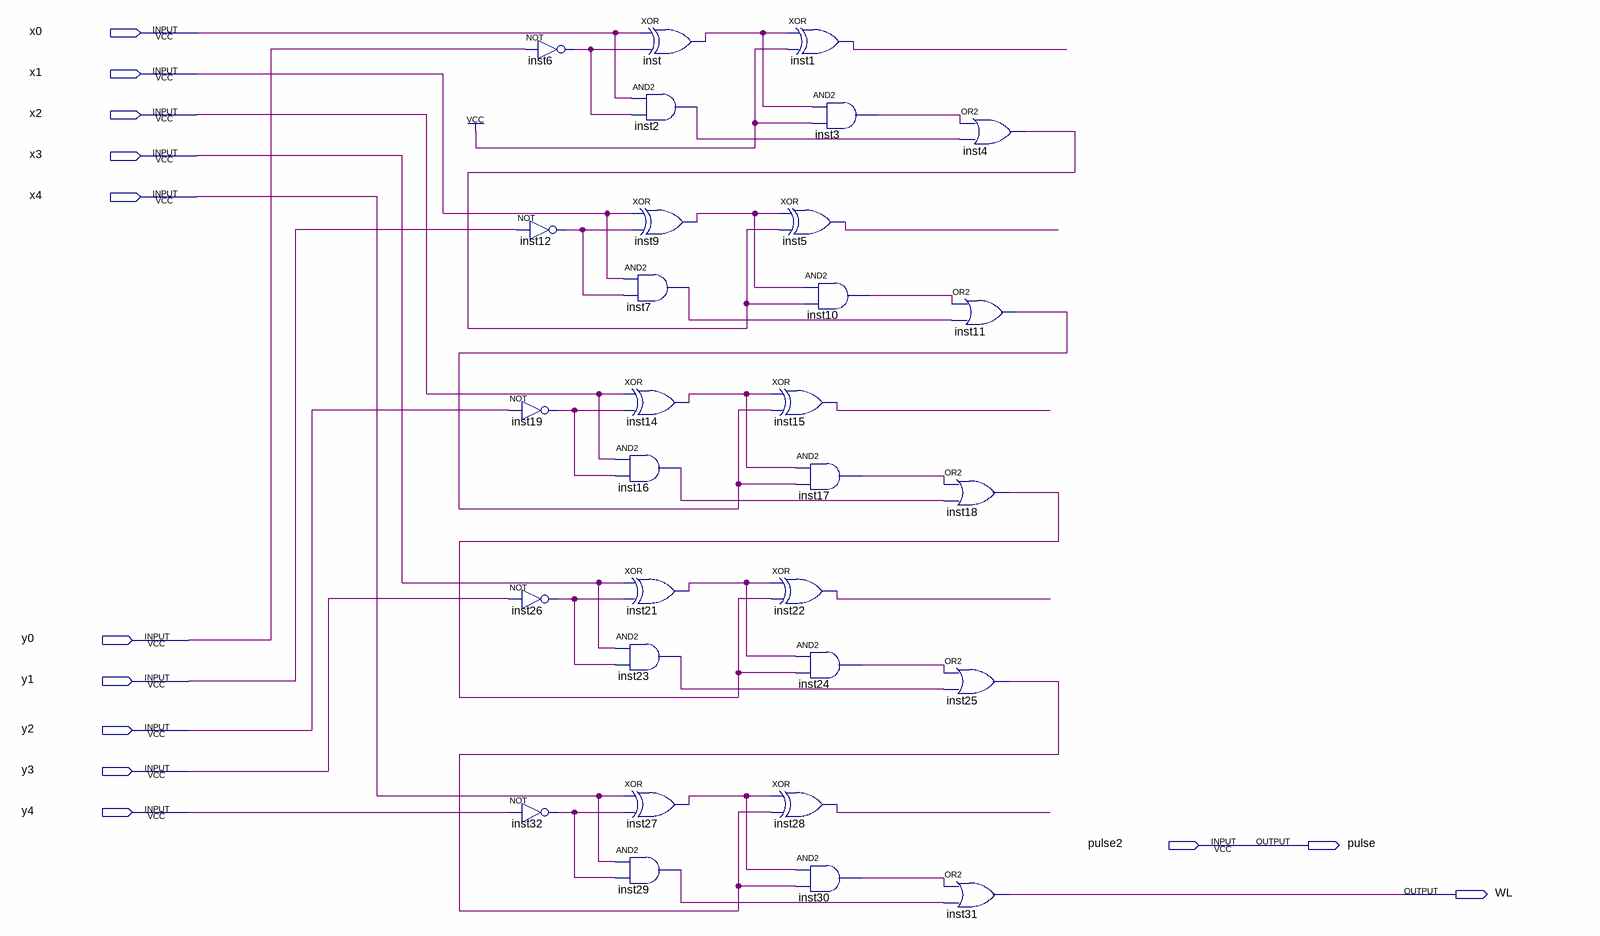
[diagram p0: schematic sheet]
// Quartus schematic Win_or_Lose.bdf as structural Verilog: 30 symbols, 13 pins
module Win_or_Lose (
  input  x0,
  input  x1,
  input  x2,
  input  x3,
  input  x4,
  input  y0,
  input  y1,
  input  y2,
  input  y3,
  input  y4,
  input  pulse2,
  output pulse,
  output WL
);

  wire inst1_out, inst2_out, inst3_out, inst4_out, inst5_out, inst6_out, inst7_out, inst9_out, inst10_out,
       inst11_out, inst12_out, inst14_out, inst15_out, inst16_out, inst17_out, inst18_out, inst19_out,
       inst21_out, inst22_out, inst23_out, inst24_out, inst25_out, inst26_out, inst27_out, inst28_out,
       inst29_out, inst30_out, inst32_out, inst_out;

  not inst12 (inst12_out, y1);
  not inst19 (inst19_out, y2);
  not inst26 (inst26_out, y3);
  not inst32 (inst32_out, y4);
  not inst6 (inst6_out, y0);
  xor inst (inst_out, x0, inst6_out);
  and inst2 (inst2_out, x0, inst6_out);
  xor inst9 (inst9_out, x1, inst12_out);
  and inst7 (inst7_out, x1, inst12_out);
  xor inst14 (inst14_out, x2, inst19_out);
  and inst16 (inst16_out, x2, inst19_out);
  xor inst21 (inst21_out, x3, inst26_out);
  and inst23 (inst23_out, x3, inst26_out);
  xor inst27 (inst27_out, x4, inst32_out);
  and inst29 (inst29_out, x4, inst32_out);
  xor inst5 (inst5_out, inst9_out, inst4_out);
  xor inst15 (inst15_out, inst14_out, inst11_out);
  xor inst22 (inst22_out, inst21_out, inst18_out);
  xor inst28 (inst28_out, inst27_out, inst25_out);
  xor inst1 (inst1_out, inst_out, 1'b1);
  and inst3 (inst3_out, inst_out, 1'b1);
  and inst10 (inst10_out, inst9_out, inst4_out);
  and inst17 (inst17_out, inst14_out, inst11_out);
  and inst24 (inst24_out, inst21_out, inst18_out);
  and inst30 (inst30_out, inst27_out, inst25_out);
  or inst4 (inst4_out, inst3_out, inst2_out);
  or inst11 (inst11_out, inst10_out, inst7_out);
  or inst18 (inst18_out, inst17_out, inst16_out);
  or inst25 (inst25_out, inst24_out, inst23_out);
  or inst31 (WL, inst30_out, inst29_out);

  assign pulse = pulse2;
endmodule
